# Altium schematic sheet Power.SchDoc
size A; SheetNumber: 3; SheetTotal: 5
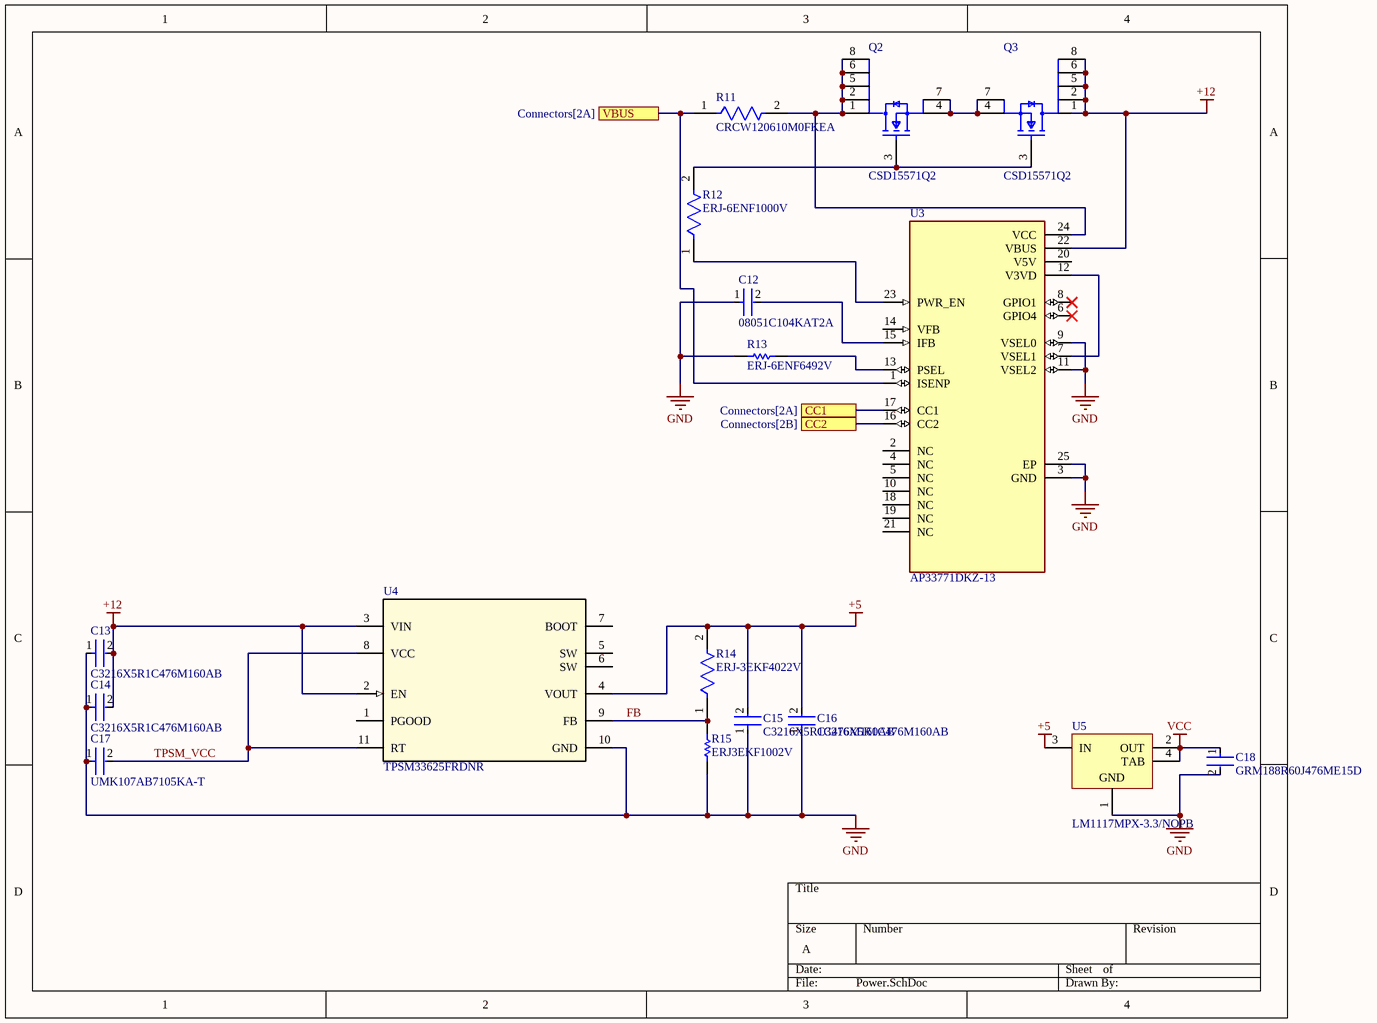
[diagram p0: Power.SchDoc]

## Parts
C12  08051C104KAT2A  [FP-0805-L_2_01_0_2-W_1_25-IPC_B]
C13  C3216X5R1C476M160AB  [FP-C3216-160-0_2-MFG]
C14  C3216X5R1C476M160AB  [FP-C3216-160-0_2-MFG]
C15  C3216X5R1C476M160AB  [FP-C3216-160-0_2-MFG]
C16  C3216X5R1C476M160AB  [FP-C3216-160-0_2-MFG]
C17  UMK107AB7105KA-T  [FP-0603-L_1_6_0_15-W_0_8-IPC_C]
C18  GRM188R60J476ME15D  [FP-GRM188-0_2-IPC_B]
Q2  CSD15571Q2  [FP-DQK0006C-MFG]
Q3  CSD15571Q2  [FP-DQK0006C-MFG]
R11  CRCW120610M0FKEA  [FP-CRCW1206-e3-IPC_B]
R12  ERJ-6ENF1000V  [FP-ERJ6EN-MFG]
R13  ERJ-6ENF6492V  [RESC2013X70X40LL20T20]
R14  ERJ-3EKF4022V  [FP-ERJ3EK-IPC_C]
R15  ERJ3EKF1002V  [RESC1609X55X30LL15T15]
U3  AP33771DKZ-13  [IC_AP33771DKZ-13]
U4  TPSM33625FRDNR  [RDN0011A-MFG]
U5  LM1117MPX-3.3/NOPB  [DCY0004A_L]

## Ports
CC1 (see Connectors[2A]), CC2 (see Connectors[2B]), VBUS (see Connectors[2A])

## Nets
+5: C15.2 C16.2 R14.2 U4.4(VOUT) U5.3(IN)
+12: C13.2 C14.2 Q3.1(D) Q3.2(D) Q3.5(D) Q3.6(D) Q3.8(D) U3.22(VBUS) U4.2(EN) U4.3(VIN)
GND: C12.1 C13.1 C14.1 C15.1 C16.1 C17.1 C18.2 R13.1 R15.1 U3.3(GND) U3.9(VSEL0) U3.11(VSEL2) U3.25(EP) U4.10(GND) U5.1(GND)
VCC: C18.1 U5.2(OUT) U5.4(TAB)
CC1: U3.17(CC1) ; port CC1
CC2: U3.16(CC2) ; port CC2
FB: R14.1 R15.2 U4.9(FB)
TPSM_VCC: C17.2 U4.8(VCC) U4.11(RT)
VBUS: R11.1 U3.1(ISENP) ; port VBUS
NetC12_2: C12.2 U3.15(IFB)
NetQ2_1: Q2.1(D) Q2.2(D) Q2.5(D) Q2.6(D) Q2.8(D) R11.2 U3.24(VCC)
NetQ2_3: Q2.3(G) Q3.3(G) R12.2
NetQ2_4: Q2.4(S) Q2.7(S) Q3.4(S) Q3.7(S)
NetR12_1: R12.1 U3.23(PWR_EN)
NetR13_2: R13.2 U3.13(PSEL)
NetU3_7: U3.7(VSEL1) U3.12(V3VD)

Not connected (* = marked no-connect by the designer): U3 2(NC) 4(NC) 5(NC) 6(GPIO4)* 8(GPIO1)* 10(NC) 14(VFB) 18(NC) 19(NC) 20(V5V) 21(NC); U4 1(PGOOD) 5(SW) 6(SW) 7(BOOT)

## Library data of the parts
C12 = CMP-2007-04174-2: General Purpose Ceramic Capacitor, 0805, 100nF, 10%, X7R, 15%, 100V; Packaging: Tape and Reel; Min Operating Temperature: -55°C; Dielectric Material: Ceramic; Height: 1.4mm; Voltage Rating: 100V; Termination: SMD/SMT; Case Code (Imperial): 0805; Case Code (Metric): 2012; Case/Package: 0805; Construction: Flat; Radiation Hardening: No; Series: -; Dielectric: X7R; Package Quantity: 2000; Mount: Surface Mount; Capacitance: 100nF; Contact Plating: Tin; Voltage: 100V; Lead Free: Lead Free; Depth: 1.25mm; RoHS Compliant: Yes; Number of Pins: 2; Max Operating Temperature: 125°C; Length: 2.01mm; Voltage Rating (DC): 100V; Thickness: 0.055inch; REACH SVHC: No SVHC; Width: 0.049inch; Tolerance: 10%
C13-C16 = CMP-2000-07442-2: Multilayer Ceramic Capacitors 47uF ±20% 16V X5R SMD 1206; Resistor Type: Ceramic; Width: 0.063inch; Case Code (Imperial): 1206; Radiation Hardening: No; Thickness: 0.071inch; Dielectric: X5R; Weight: 0.000571oz; Termination: SMD/SMT; Dielectric Material: Ceramic; Min Operating Temperature: -55°C; Depth: 1.6mm; Case Code (Metric): 3216; Max Operating Temperature: 85°C; RoHS Compliant: Yes; REACH SVHC: No SVHC; Mount: Surface Mount; Lead Free: Lead Free; Height: 1.6mm; Length: 3.2mm; Tolerance: 20%; Voltage Rating (DC): 16V; Capacitance: 47uF; Package Quantity: 1; Construction: Flat; Packaging: Tape and Reel; Series: C; Case/Package: 1206; Voltage Rating: 16V
C17 = CMP-2000-07531-4: Ceramic Capacitor General Use 1uF ±10% 50V X7R 0603; Series: M; Width: 0.031inch; Mount: Surface Mount; Radiation Hardening: No; Voltage Rating (DC): 50V; Packaging: Tape and Reel; Termination: SMD/SMT; Depth: 0.8mm; Case Code (Metric): 1608; Case Code (Imperial): 0603; Height: 0.8mm; Voltage Rating: 50V; Package Quantity: 1; Halogen Free: Halogen Free; Dielectric: X7R; Min Operating Temperature: -55°C; Length: 1.6mm; Construction: Flat; Tolerance: 10%; Thickness: 0.037inch; Max Operating Temperature: 125°C; Case/Package: 0603; Capacitance: 1uF; RoHS Compliant: Yes
C18 = CMP-2000-05444-2: Chip Multilayer Ceramic Capacitors for General Purpose, 0603, 47uF, X5R, 15%, 20%, 6.3V; Voltage Rating (DC): 6.3V; Thickness: 0.039inch; Case Code (Imperial): 0603; Packaging: Tape and Reel; Capacitance: 47uF; Width: 0.031inch; Dielectric: X5R; Max Operating Temperature: 85°C; Mount: Surface Mount; Case Code (Metric): 1608; Length: 0.063inch; Voltage Rating: 6.3V; Tolerance: 20%; Case/Package: 0603; Min Operating Temperature: -55°C
Q2 Q3 = CMP-04962-000051-1: MOSFET N-CH 20V 22A 6SON; Rds On Max: 15mR; Power Dissipation: 2.5W; Turn-Off Delay Time: 9.9ns; Number of Elements: 2; Number of Channels: 1; Turn-On Delay Time: 17.2ns; Input Capacitance: 419pF; Fall Time: 4.1ns; Drain to Source Resistance: 19.2mR; Element Configuration: Single; Contact Plating: Tin; Drain to Source Voltage (Vdss): 20V; Number of Pins: 6; Max Power Dissipation: 2.5W; Min Operating Temperature: -55°C; Max Operating Temperature: 150°C; Packaging: Tape and Reel; Rise Time: 17.2ns; Mount: Surface Mount; Gate to Source Voltage (Vgs): 20V; Drain to Source Breakdown Voltage: 20V; Lead Free: Lead Free; Continuous Drain Current (ID): 22A; Package Quantity: 3000
R11 = CMP-1014-00962-3: RES Thick Film, 10MΩ, 1%, 0.25W, 100ppm/°C, 1206; Working Voltage: 200V; Power Rating: 250mW; Resistance: 10MR; Height: 0.024inch; Length: 3.2mm; Packaging: Tape and Reel; Lead Free: Lead Free; Composition: Thick Film; Tolerance: 1%; Max Operating Temperature: 155°C; Depth: 1.6mm; Temperature Coefficient: 100ppm/°C; Termination: SMD/SMT; Max Power Dissipation: 250mW; Number of Terminations: 2; Weight: 0.000353oz; Voltage Rating (DC): 200V; Min Operating Temperature: -55°C; Case/Package: 1206; Military Standard: Not; Voltage Rating: 200V; Radiation Hardening: No; Case Code (Imperial): 1206; Case Code (Metric): 3216; Width: 0.063inch; Package Quantity: 10; Contact Plating: Tin; Features: Automotive AEC-Q200
R12 = CMP-2001-04374-6: RES SMD 100 OHM 1% 1/8W 0805; Resistance: 100R; Temperature Coefficient: 100ppm/°C; Voltage Rating (DC): 150V; Max Power Dissipation: 125mW; Case Code (Imperial): 0805; Termination: SMD/SMT; Number of Pins: 2; Case Code (Metric): 2012; Resistor Type: Thick Film; Lead Free: Lead Free; Series: ERJ; Size Code: 0805; Min Operating Temperature: -55°C; RoHS Compliant: Yes; Radiation Hardening: No; Technology: THICK FILM; Contact Plating: Tin; Length: 2mm; Resistance Tolerance: 1%; Military Standard: Not; Case/Package: 0805; REACH SVHC: No SVHC; Max Operating Temperature: 155°C; Construction: Rectangular; Packaging: Tape and Reel; Tolerance: 1%; Voltage Rating: 150V; Power Rating: 125mW; Depth: 1.25mm; Width: 1.2mm; Package Quantity: 1; Mount: Surface Mount; Height: 0.6mm; Number of Terminations: 2; Features: Automotive AEC-Q200
R13 = CMP-2001-00264-1: Manufacturer: Panasonic; Part Number: ERJ-6ENF6492V
R14 = CMP-2000-00486-2: RES SMD 40.2K OHM 1% 1/10W 0603; Power Rating: 100mW; Resistance: 40.2kR; Voltage Rating: 75V; Temperature Coefficient: 100ppm/°C; Voltage Rating (DC): 50V; Military Standard: Not; Lead Free: Lead Free; Resistor Type: Thick Film; Weight: 7.1E-05oz; Resistance Tolerance: 1%; Number of Terminations: 2; Min Operating Temperature: -55°C; Depth: 0.8mm; Max Power Dissipation: 100mW; Length: 1.6mm; Case Code (Imperial): 0603; Max Operating Temperature: 155°C; Series: ERJ; Radiation Hardening: No; Features: Automotive AEC-Q200; Mount: Surface Mount; Package Quantity: 1; Packaging: Tape and Reel; Height: 0.45mm; Width: 0.031inch; RoHS Compliant: Yes; Case/Package: 0603; Tolerance: 1%; Contact Plating: Tin; Technology: THICK FILM; Construction: Rectangular; Case Code (Metric): 1608; Termination: SMD/SMT
R15 = CMP-1012-00623-3: Chip Resistor, 10 KOhm, +/- 1%, 0.1 W, -55 to 155 degC, 0603 (1608 Metric), RoHS, Tape and Reel; Manufacturer: Panasonic; Voltage Rating: 75V; Case\/Package: 0603; Power Rating: 100mW; Resistance: 10KOhm; Temperature Coefficient: 100ppm\/degreesC; Number of Pins: 2; Package Reference: 603; Depth: 0.8mm; Mount: SurfaceMount; Package Description: 2-Pin Surface Mount Device, Body 1.6 x 0.85 mm; Datasheet Version: 02/2017; Length: 1.6mm; Lead Free: LeadFree; Height: 0.45mm; Number of Terminations: 2; Max Power Dissipation: 100mW; Min Operating Temperature: -55degC; Datasheet URL: https://industrial.panasonic.com/cdbs/www-data/pdf/RDA0000/AOA0000C304.pdf; Termination: SMD/SMT; Case Code (Metric): 1608; Case Code (Imperial): 0603; Tolerance: 1%; Max Operating Temperature: 155degC; RoHSCompliant: true; Voltage Rating (DC): 75V; Radiation Hardening: No; Packaging: TapeandReel; Composition: ThickFilm; Mounting Technology: SurfaceMount; Manufacturer URL: http://www.panasonic.com/; Width: 0.031inch; REACH SVHC: NoSVHC; Contact Plating: Tin; Military Standard: Not; Package Quantity: 1
U3 = AP33771DKZ-13: MF: {'manufacturer': u'Diodes Incorporated'}; Package: None; Price: None; Value: *; MP: AP33771DKZ-13; Availability: Unavailable
U4 = CMP-054-000002-4: No Description Available; Mfr_Name: Texas Instruments; Design Item ID: TPSM33625FRDNR; Source: TPSM33625FRDNR.SchLib; TYPE: TYPE; RefDes: RefDes
U5 = CMP-0062-01639-4: 800mA Low-Dropout Linear Regulator, 4-pin SOT-223, Pb-Free; Manufacturer: Texas Instruments; High-Reliability: Y; PowerWise: N; PackageTopMarking: XYTT*N05A; CompType: LDO IC; ComponentLink1URL: http://www.ti.com/general/docs/lit/getliterature.tsp?genericPartNumber=LM1117-N&fileType=pdf; PartNumber: LM1117MPX-3.3/NOPB; ComponentLink1Description: Datasheet URL; PinCount: 4; Code_JEDEC: TO-261-AA; PackageDescription: Molded SOT-223, 6.50 x 3.56 x 1.6mm Body, 4 Lead, 2.3mm Pitch; PackageReference: DCY0004A; RoHS: Y; Code_IPC: SOT223-4